# Altium schematic sheet Energy-Meter.SchDoc: Smart Energy Meter – Main Board
size A; CompanyName: Bleu Land; DrawnBy: Fox Black; Engineer: Fox Black; DocumentNumber: SEM-MB-001; Revision: A; SheetNumber: 1; SheetTotal: 1
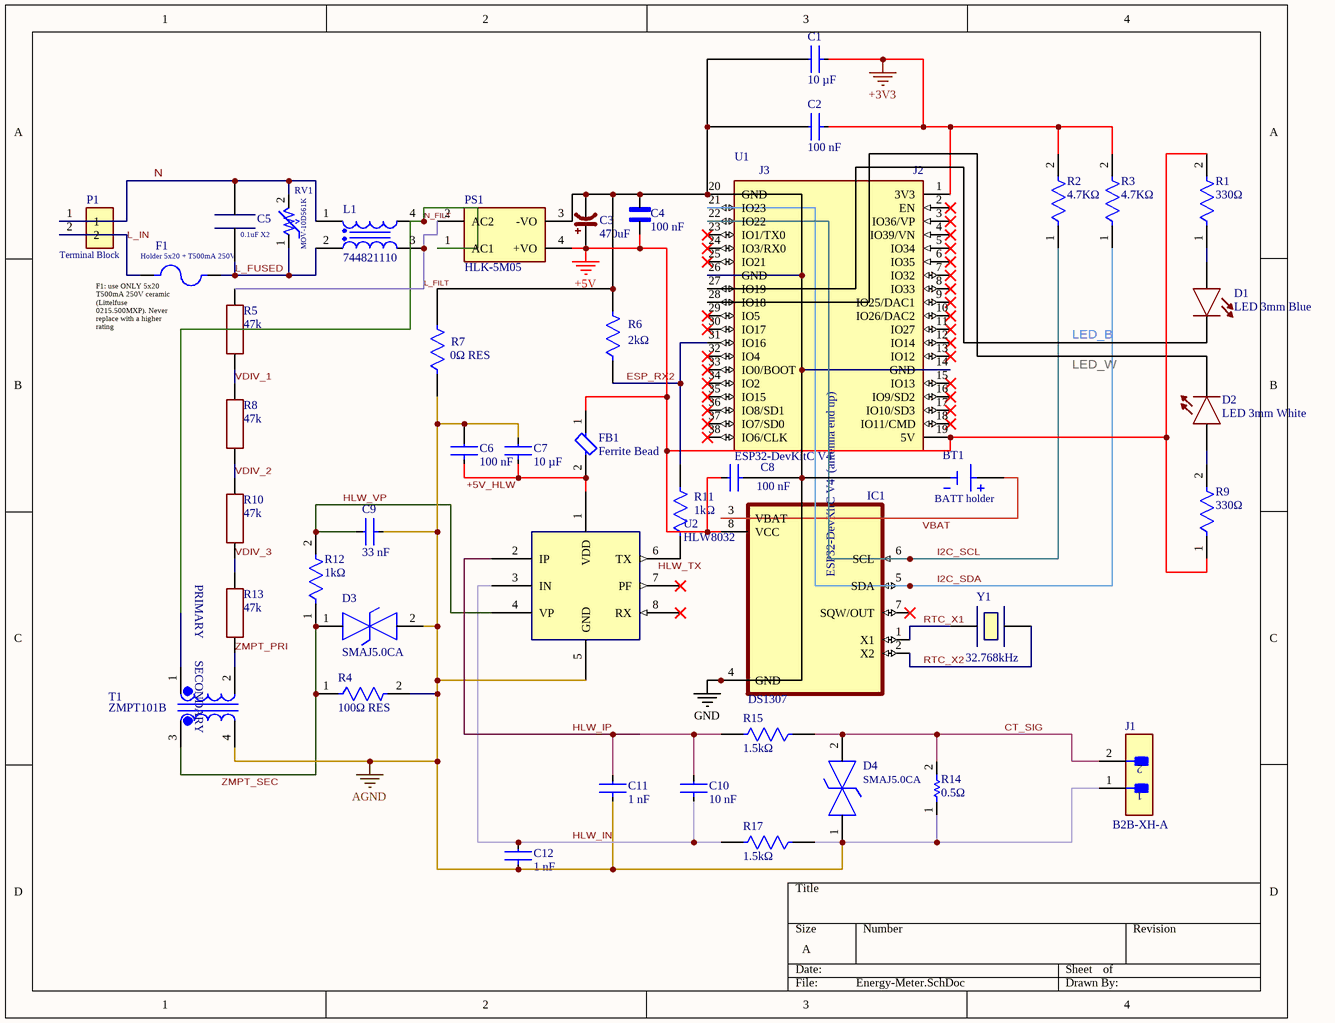
[diagram p0: Energy-Meter.SchDoc]

## Parts
BT1  BATT holder  [BAT_BH32T-C-G]
C1  10 µF  [FP-1206-L_3_2_0_2-W_1_6_0-MFG]
C2  100 nF  [FP-C1206C-EB-MFG]
C3  470uF  [CAPPRD350W60D800H1150_LAYDOWN]
C4  100 nF  [CAPRR508W50L508T318H762]
C5  0.1uF X2  [CAPX2_L18.0-W6.0-H11.0_P15.00]
C6  100 nF  [FP-C1206C-EB-MFG]
C7  10 µF  [FP-GRM31C-0_2-e0_3_0_8-IPC_C]
C8  100 nF  [FP-C1206C-EB-MFG]
C9  33 nF  [FP-C1206C-EB-MFG]
C10  10 nF  [FP-C1206C-EB-MFG]
C11  1 nF  [FP-C1206C-EB-MFG]
C12  1 nF  [FP-C1206C-EB-MFG]
D1  LED 3mm Blue  [LED_D3.0MM_P2.54_BLUE]
D2  LED 3mm White  [LED_D3.0MM_P2.54_WHITE]
D3  SMAJ5.0CA  [FP-SMAJ-MFG]
D4  SMAJ5.0CA  [FP-SMAJ-MFG]
F1  Holder 5x20 + T500mA 250V  [FUSE_4628]
FB1  Ferrite Bead  [FP-BLM31-0_2-t1_6-IPC_B]
IC1  DS1307  [DIP794W47P254L991H457Q8]
J1  B2B-XH-A  [FP-B2B-XH-AM_LF_SN-MFG]
L1  744821110  [WE-CMB_Type XS_L15W7.5H18]
P1  Terminal Block  [TE_282837-2]
PS1  HLK-5M05  [CONV_HLK-5M05]
R1  330Ω  [FP-AC2512-MFG]
R2  4.7KΩ  [FP-AC2512-MFG]
R3  4.7KΩ  [FP-AC2512-MFG]
R4  100Ω RES  [FP-MCA1206-IPC_A]
R5  47k  [RESAD762W55L630D240_MF]
R6  2kΩ  [FP-CRCW2512-e3-IPC_A]
R7  0Ω RES  [FP-RMCF2512-IPC_A]
R8  47k  [RESAD762W55L630D240_MF]
R9  330Ω  [FP-AC2512-MFG]
R10  47k  [RESAD762W55L630D240_MF]
R11  1kΩ  [FP-CRCW2512-e3-IPC_A]
R12  1kΩ  [FP-RMCF1206-IPC_C]
R13  47k  [RESAD762W55L630D240_MF]
R14  0.5Ω  [RESC6432X89X76ML25T25]
R15  1.5kΩ  [FP-CRCW2512-e3-IPC_A]
R17  1.5kΩ  [FP-CRCW2512-e3-IPC_A]
RV1  MOV-10D561K  [VAR_MOV-10D561K]
T1  ZMPT101B  [XFMR_ZMPT101B]
U1  ESP32-DevKitC V4  [ESP32-DEVKITC-V4_SOCKET]
U2  HLW8032  [SOIC127P600X175-8N]
Y1  32.768kHz  [XTAL_D3.2xL8.3_P2.00_Vertical]

## Nets
+3V3: C1.1 C2.1 R2.2 R3.2 U1.1(3V3)
+5V: C3.1(+) C4.1 C8.2 FB1.1 IC1.8(VCC) PS1.4(+VO) R1.2 R9.1 U1.19(5V)
AGND: C6.2 C7.2 C9.1 C11.1 C12.1 D3.2 D4.1 J1.1 R4.2 R7.1 R14.1 R17.1 T1.4 U2.5(GND)
GND: BT1.NEG C1.2 C2.2 C3.2(-) C4.2 C8.1 IC1.4(GND) PS1.3(-VO) R6.2 R7.2 U1.14(GND) U1.20(GND) U1.26(GND)
+5V_HLW: C6.1 C7.1 FB1.2 U2.1(VDD)
CT_SIG: D4.2 J1.2 R14.2 R15.1
ESP_RX2: R6.1 R11.2 U1.31(IO16)
HLW_IN: C10.1 C12.2 R17.2 U2.3(IN)
HLW_IP: C10.2 C11.2 R15.2 U2.2(IP)
HLW_TX: R11.1 U2.6(TX)
HLW_VP: C9.2 R12.2 U2.4(VP)
I2C_SCL: IC1.6(SCL) R2.1 U1.22(IO22)
I2C_SDA: IC1.5(SDA) R3.1 U1.21(IO23)
L_FILT: L1.3 PS1.2(AC2) R5.2
L_FUSED: C5.1 F1.2 L1.2 RV1.1
L_IN: F1.1 P1.2
LED_B: D1.1(K) U1.27(IO19)
LED_W: D2.1(K) U1.28(IO18)
N: C5.2 L1.1 P1.1 RV1.2
N_FILT: L1.4 PS1.1(AC1) T1.1
RTC_X1: IC1.1(X1) Y1.1
RTC_X2: IC1.2(X2) Y1.2
VBAT: BT1.POS IC1.3(VBAT)
VDIV_1: R5.1 R8.2
VDIV_2: R8.1 R10.2
VDIV_3: R10.1 R13.2
ZMPT_PRI: R13.1 T1.2
ZMPT_SEC: D3.1 R4.1 R12.1 T1.3
NetD1_2: D1.2(A) R1.1
NetD2_2: D2.2(A) R9.2

Not connected (* = marked no-connect by the designer): IC1 7(SQW/OUT)*; U1 2(EN)* 3(IO36/VP)* 4(IO39/VN)* 5(IO34)* 6(IO35)* 7(IO32)* 8(IO33)* 9(IO25/DAC1)* 10(IO26/DAC2)* 11(IO27)* 12(IO14)* 13(IO12)* 15(IO13)* 16(IO9/SD2)* 17(IO10/SD3)* 18(IO11/CMD)* 23(IO1/TX0)* 24(IO3/RX0)* 25(IO21)* 29(IO5)* 30(IO17)* 32(IO4)* 33(IO0/BOOT)* 34(IO2)* 35(IO15)* 36(IO8/SD1)* 37(IO7/SD0)* 38(IO6/CLK)*; U2 7(PF)* 8(RX)*

## Notes on the sheet
- (near F1) F1: use ONLY 5x20 T500mA 250V ceramic (Littelfuse 0215.500MXP). Never replace with a higher rating
- (in symbol ESP32-DEVKITC-V4) J3; J2; ESP32-DevKitC V4  (antenna end up)
- (in symbol ZMPT101B) PRIMARY; SECONDARY

## Library data of the parts
BT1 = BH32T-C-G: BATTERY HOLDER COIN 20MM PC PIN; Manufacturer: MPD; Manufacturer Part Number: BH32T-C-G
C1 = CMP-04427-021870-1: General Purpose Ceramic Capacitor, 1206, 10uF, 10%, X5R, 15%, 10V; Manufacturer: KYOCERA AVX; Manufacturer Part Number: 1206ZD106KAT2A; Tolerance: 10%; Thickness: 0.07inch; Voltage: 10V; Termination: SMD/SMT; REACH SVHC: No SVHC; Radiation Hardening: No; Capacitance: 10uF; Lead Free: Lead Free; Min Operating Temperature: -55°C; Contact Plating: Tin; Length: 3.2mm; Dielectric: X5R; Packaging: Tape and Reel; Construction: Flat; RoHS Compliant: Yes; Series: -; Voltage Rating: 10V; Height: 0.07mm; Width: 0.063inch; Voltage Rating (DC): 10V; Mount: Surface Mount; Depth: 1.6mm; Number of Pins: 2; Case Code (Imperial): 1206; Size: 1.78mm; Case/Package: 1206; Max Operating Temperature: 85°C; Package Quantity: 1; Case Code (Metric): 3216
C2 C6 C8 = CMP-03020-014296-1: CAP CER 0.1UF 25V X7R 1206; Manufacturer: KEMET; Manufacturer Part Number: C1206C104J3RACTU; Material: Ceramic; Value: 0.10 μF; Automotive Grade: Grade 0; Tolerance: 0.05; Temperature Coefficient: 15%; Octopart: https://octopart.com/c1206c104j3ractu-kemet-9140182; Height: 0.88mm; Ipc Land Pattern Name: CAPC320160X78; Digikey Description: CAP CER 0.1UF 25V X7R 1206; Device Class L3: Ceramic Capacitors; Device Class L2: Capacitors; Device Class L1: Passive Components; Voltage Rating: 25 V; RoHS: TRUE; Temperature Range Low: -55°C; Temperature Characteristic: X7R; Mouser Description: Cap Ceramic 0.1uF 25V X7R 5% SMD 1206 125°C Plastic T/R; Capacitance: 0.10 μF; ComponentLink2Description: Datasheet; Temperature: -55°C to +150°C; Automotive: Yes; Category: Cap; Temperature Range High: +150°C; ComponentLink2URL: https://content.kemet.com/datasheets/KEM_C1007_X8R_ULTRA_150C_SMD.pdf; Package: C1206C-EB; Lead Free: Yes
C3 = CAP_POL_470UF_10V_D8X11.5_LD: Capacitor, aluminium electrolytic, 470 uF, 10 V, 20%, radial D8x11.5mm, 3.5mm pitch, laid down; Manufacturer: Rubycon; Manufacturer Part Number: 10YXF470MEFC8X11.5; Capacitance: 470 µF; Voltage Rating: 10V; Polarized: Yes; Lead Diameter: 0.6mm; Lifetime: 6000h @ 105°C; Value: 470uF; Tolerance: ±20%; Technology: Aluminium Electrolytic; Case Size: D8 x L11.5 mm; Lead Spacing: 3.5mm; Mounting: THT, laid down (horizontal), leads bent 2mm from seal; Operating Temperature: -40°C ~ +105°C; ComponentLink1Description: Product page; ComponentLink1URL: https://www.digikey.com/product-detail/en/rubycon/10YXF470MEFC8X11-5/1189-1868-ND/3563329
C4 = AR215C104K4R: AR 100nF Ceramic Multilayer Cap,50V dc,+125C,X7R Dielectric,+/-10%,Through Hole | AVX AR215C104K4R; Package: Radial AVX; Manufacturer: AVX; Manufacturer Part Number: AR215C104K4R
C5 = CAP-X2-0.1uF-275VAC: Capacitor 0.1uF +/-10%, 275 VAC class X2, MKP polypropylene film, 40/100/21, radial through hole, 15 mm pitch; Manufacturer: TDK; Manufacturer Part Number: B32922C3104K000; Tolerance: +/-10% (K); Voltage: 305 VAC X2; Safety Class: X2, EN60384-14; Value: 0.1uF; Dielectric: MKP polypropylene film; Climatic Category: 40/100/21; Package: Boxed radial 18.0 x 11.0 x 6.0, P15
C7 = CMP-06035-005515-1: Chip Multilayer Ceramic Capacitors for General Purpose, 1206, 10uF, X7R, 15%, 10%, 25V; Manufacturer: Murata; Manufacturer Part Number: GRM31CR71E106KA12L; Dielectric: X7R; Max Operating Temperature: 125°C; Capacitance: 10uF; Voltage Rating (DC): 25V; Case/Package: 1206; Thickness: 0.071inch; Tolerance: 10%; Voltage Rating: 25V; Mount: Surface Mount; Width: 0.063inch; Length: 0.126inch; Min Operating Temperature: -55°C; Packaging: Tape and Reel; Lead Free: Lead Free; Voltage: 25V
C9 = CMP-03020-013243-1: C1206 33,000 pF C0G 5.00% 50 V; Manufacturer: KEMET; Manufacturer Part Number: C1206C333J5GACAUTO; Automotive Grade: Grade 0; Temperature Coefficient: 15%; Material: Ceramic; Voltage Rating: 50 V; Tolerance: 0.05; Package: C1206C-EB; ComponentLink2Description: Datasheet; Temperature Characteristic: C0G; Height: 0.88mm; Capacitance: 33,000 pF; Value: 33,000 pF; ComponentLink2URL: https://content.kemet.com/datasheets/KEM_C1007_X8R_ULTRA_150C_SMD.pdf; Lead Free: Yes; Device Class L1: Passive Components; Category: Cap; Octopart: https://octopart.com/c1206c333j5gacauto-kemet-84841138; Temperature Range High: +150°C; Automotive: Yes; Ipc Land Pattern Name: CAPC320160X78; Device Class L3: Ceramic Capacitors; Temperature: -55°C to +150°C; Device Class L2: Capacitors; Temperature Range Low: -55°C; RoHS: TRUE
C10 = CMP-03020-012568-1: CAP CER 10000PF 100V C0G 1206; Manufacturer: KEMET; Manufacturer Part Number: C1206C103J1GACAUTO; Material: Ceramic; Temperature Coefficient: 15%; Value: 10,000 pF; Tolerance: 0.05; Automotive Grade: Grade 0; Device Class L1: Passive Components; Height: 0.88mm; RoHS: TRUE; Voltage Rating: 100 V; Device Class L2: Capacitors; ComponentLink2Description: Datasheet; Temperature Range High: +150°C; Digikey Description: CAP CER 10000PF 100V C0G 1206; Temperature Range Low: -55°C; ComponentLink2URL: https://content.kemet.com/datasheets/KEM_C1007_X8R_ULTRA_150C_SMD.pdf; Ipc Land Pattern Name: CAPC320160X78; Temperature Characteristic: C0G; Category: Cap; Octopart: https://octopart.com/c1206c103j1gacauto-kemet-84841126; Lead Free: Yes; Automotive: Yes; Package: C1206C-EB; Capacitance: 10,000 pF; Temperature: -55°C to +150°C; Device Class L3: Ceramic Capacitors
C11 C12 = CMP-03020-025981-1: C1206 1,000 pF C0G 5.00% 200 V; Manufacturer Part Number: C1206C102J2GACAUTO; Manufacturer: KEMET; Automotive Grade: Grade 0; Temperature Coefficient: 15%; Material: Ceramic; Voltage Rating: 200 V; Tolerance: 0.05; Capacitance: 1,000 pF; Temperature: -55°C to +150°C; Ipc Land Pattern Name: CAPC320160X78; Device Class L1: Passive Components; Device Class L3: Ceramic Capacitors; ComponentLink2URL: https://content.kemet.com/datasheets/KEM_C1007_X8R_ULTRA_150C_SMD.pdf; Value: 1,000 pF; Category: Cap; RoHS: TRUE; Temperature Range Low: -55°C; Octopart: https://octopart.com/c1206c102j2gacauto-kemet-65740696; Height: 0.88mm; ComponentLink2Description: Datasheet; Automotive: Yes; Temperature Characteristic: C0G; Temperature Range High: +150°C; Lead Free: Yes; Device Class L2: Capacitors; Package: C1206C-EB
D1 = LED_3MM_BLUE_DIFFUSED: LED, 3mm round, blue diffused, THT 2.54mm; Manufacturer: Kingbright; Manufacturer Part Number: WP710A10QBD/D; Polarity: Pin 1 = K (cathode, square pad, flange flat, short lead); Pin 2 = A; Wavelength: 460nm peak; Forward Voltage: 3.3V typ / 4.0V max @ 20mA; Forward Current: 20mA typ / 30mA max; Reverse Voltage: 5V; Viewing Angle: 50 deg (diffused); Series Resistor @5V: 91-100 ohm (~17mA); Value: LED 3mm Blue; Package: 3mm (T-1) round, 2.54mm lead spacing; Lens: Blue diffused; Mounting: THT upright, flange ~1mm above board; Emitting Color: Blue; Operating Temperature: -40°C ~ +85°C; ComponentLink1Description: Part info; ComponentLink1URL: https://octopart.com/part/kingbright/WP710A10QBD%2FD
D2 = LED_3MM_WHITE_DIFFUSED: LED, 3mm round, white diffused, THT 2.54mm; Manufacturer: Kingbright; Manufacturer Part Number: L-7104QWC-D; Lens: Water clear; Polarity: Pin 1 = K (cathode, square pad, flange flat, short lead); Pin 2 = A; Emitting Color: White (cool white, ~6500K); Forward Voltage: 3.2V typ / 3.6V max @ 20mA; Forward Current: 20mA typ / 30mA max; Reverse Voltage: 5V; Viewing Angle: ~60 deg (diffused); Series Resistor @5V: 100 ohm (~18mA); Value: LED 3mm White; Package: 3mm (T-1) round, 2.54mm lead spacing; Mounting: THT upright, flange ~1mm above board; Operating Temperature: -40°C ~ +85°C
D3 D4 = CMP-2000-07091-2: TVS DIODE 5V 9.2V SMA; Manufacturer: Bourns Inc.; Direction: Bidirectional; Standoff Height: 0.05mm; Breakdown Voltage: 6.4V; Number Of Channels: 1; Max Junction Temp: +150°C; Peak Pulse Power: 400W; Lead Free: Yes; Digikey Description: TVS DIODE 5V 9.2V SMA; Automotive: No; Temperature: -55°C to +150°C; Package: SMAJ; Temperature Range Low: -55°C; Octopart: https://octopart.com/smaj5.0ca-bourns-12809390; Device Class L2: TVS Diodes; Device Class L3: unset; ComponentLink2URL: https://bourns.com/data/global/pdfs/SMAJ.pdf; RoHS: TRUE; ComponentLink2Description: Datasheet; Mouser Description: TVS Diodes - Transient Voltage Suppressors 5volts 800/1600uA 43.5 Amps Bi-Dir; Reverse Standoff Voltage: 5V; Temperature Range High: +150°C; Height: 2.62mm; Manufacturer Part Number: SMAJ5.0CA; Category: Diode; Device Class L1: Circuit Protection
F1 = 4628: 5mm Slim Line Fuse holder; Manufacturer: Keystone; Fuse Insert: Littelfuse 0215.500MXP (T500mA 250VAC ceramic 1.5kA); Manufacturer Part Number: 4628
FB1 = CMP-06046-002432-1: Chip Ferrite Bead, 1206, 600Ω @ 100MHz, 0.038Ω, 25%, 2.9A; Manufacturer: 125°C; Number of Lines: 1; DC Resistance (DCR): 38mR; Max Operating Temperature: 125°C; Packaging: Cut Tape; Min Operating Temperature: -55°C; Mount: Surface Mount; Case Code (Metric): 3216; Case/Package: 1206; Case Code (Imperial): 1206; Max Current Rating: 2.9A; Manufacturer Part Number: 125°C
IC1 = DS1307: Real Time Clock (RTC) I²C, 56 B RAM, 8-DIP; Manufacturer: Analog Devices; Manufacturer Part Number: DS1307+; Package: DIP-8 Maxim Integrated
J1 = CMP-17439-000037-1: CONN HEADER VERT 2POS 2.5MM; Manufacturer: JST; Manufacturer Part Number: B2B-XH-AM(LF)(SN); Max Voltage Rating (AC): 250V; Connector Type: Male Pin; Contact Resistance: 20mR; Max Current Rating: 3A; Number of Positions: 2; Series: XH; Contact Material: Brass; Mount: Through Hole; Housing Material: Polyamide; Contact Plating: Tin; Termination: Solder; Max Operating Temperature: 85°C; Depth: 5.75mm; Packaging: Bulk; Min Operating Temperature: -25°C; Contact Type: Male Pin; Color: Green; Pitch: 2.5mm; Length: 7.4mm; Lead Free: Lead Free; Number of Rows: 1; Fastening Type: Detent; Housing Color: White; Orientation: Straight
L1 = CMP-0223-00077-2: NexarPartId: 22865126; Manufacturer: Wurth Elektronik; Inductance: 10mH; Series Resistance: 350mΩ; Current: 700mA; Tolerance: 30%; Pin Length: 2.5mm; Voltage Rating: 250V; Test Frequency: 10kHz; Number of Lines: 2; Termination: Radial; Lead Pitch: 4.5mm; Height: 18mm; Width: 7.5mm; Packaging: Bulk; REACH SVHC: No SVHC; DC Current: 700mA; Min Operating Temperature: -40°C; Lead Free: Lead Free; Ambient Temperature Range High: 70°C; Depth: 7.5mm; Max Operating Temperature: 125°C; Length: 15mm; Current Rating: 700mA; DC Resistance (DCR): 350mΩ; Resistance: 350MΩ; Max DC Current: 700mA; Number of Pins: 4; Inductance Tolerance: 30%; Ambient Temperature Range Low: -40°C; RoHS: Compliant; Mount: Radial, Through Hole; Case/Package: Radial; Manufacturer Part Number: 744821110
P1 = 282837-2: Ð Ð°Ð·ÑŠÐµÐ¼Ð½Ñ‹Ðµ ÐºÐ»ÐµÐ¼Ð¼Ð½Ñ‹Ðµ ÐºÐ¾Ð»Ð¾Ð´ÐºÐ¸ Ð Ð¾Ð·ÐµÑ‚ÐºÐ° 2 Ð¿Ð¾Ð»Ð¾Ð¶ÐµÐ½Ð¸Ñ 5,08 Ð¼Ð¼ ÐŸÑ€Ð¸Ð¿Ð¾Ð¹ Ð¿Ñ€ÑÐ¼Ð¾Ð¹ Ñ‡ÐµÑ€ÐµÐ· Ð¾Ñ‚Ð²ÐµÑ€ÑÑ‚Ð¸Ðµ 13,5 Ð / ÐºÐ¾Ð½Ñ‚Ð°ÐºÑ‚; Manufacturer: TE Connectivity; Manufacturer Part Number: 282837-2
PS1 = HLK-5M05: AC DC 220V to 5V 5W 5Watt Isolated Switching Step-Down Power Supply Module Converter; Manufacturer: Hi-link; Manufacturer Part Number: HLK-5M05
R1 R9 = CMP-03412-030391-1: RES SMD 330 OHM 5% 1W 2512; Manufacturer: Yageo; Manufacturer Part Number: AC2512JK-07330RL; Automotive Grade: Grade 0; Tolerance: 0.05; Voltage Rating: 200V; Series: AC; Device Class L2: Resistors; Device Class L3: Chip SMD Resistors; Temperature Range Low: -55°C; Footprint Url: http://www.yageo.com/exep/pages/download/literatures/PYu-R_Mount_10.pdf; Digikey Description: RES SMD 330 OHM 5% 1W 2512; Resistance: 330Ω; Octopart: https://octopart.com/ac2512jk-07330rl-yageo-71370368; ComponentLink2Description: Datasheet; ComponentLink2URL: http://www.yageo.com/documents/recent/PYu-AC_51_RoHS_L_6.pdf; Value: 330Ω; Composition: Thick Film; Automotive: Yes; Ipc Land Pattern Name: RESC635310X55; Temperature: -55°C to +155°C; Temperature Range High: +155°C; Device Class L1: Passive Components; Height: 0.65mm; Category: Res; Power Rating: 1W; Package: AC2512; RoHS: TRUE; Lead Free: Yes
R2 R3 = CMP-03412-032212-1: RES SMD 4.7K OHM 1% 1W 2512; Manufacturer: Yageo; Manufacturer Part Number: AC2512FK-074K7L; Voltage Rating: 200V; Automotive Grade: Grade 0; Tolerance: 0.01; Resistance: 4.7KΩ; Temperature Range High: +155°C; Category: Res; RoHS: TRUE; ComponentLink2Description: Datasheet; Device Class L1: Passive Components; ComponentLink2URL: http://www.yageo.com/documents/recent/PYu-AC_51_RoHS_L_6.pdf; Package: AC2512; Series: AC; Power Rating: 1W; Temperature: -55°C to +155°C; Octopart: https://octopart.com/ac2512fk-074k7l-yageo-71370127; Lead Free: Yes; Value: 4.7KΩ; Height: 0.65mm; Digikey Description: RES SMD 4.7K OHM 1% 1W 2512; Footprint Url: http://www.yageo.com/exep/pages/download/literatures/PYu-R_Mount_10.pdf; Device Class L2: Resistors; Automotive: Yes; Temperature Range Low: -55°C; Device Class L3: Chip SMD Resistors; Composition: Thick Film; Ipc Land Pattern Name: RESC635310X55
R4 = CMP-02407-001396-1: Res MC AT Precision Thin Film 1206 100Ω 0.1% 0.4W ±25ppm/°C Molded Paper T/R; Manufacturer: Vishay; Manufacturer Part Number: MCA1206MD1000BP100; Resistance: 100R; Max Power Dissipation: 400mW; Voltage Rating: 200V; Number of Terminations: 2; Termination: SMD/SMT; Height: 0.026inch; Length: 0.126inch; Composition: Thin Film; Package Quantity: 1000; Min Operating Temperature: -55°C; Max Operating Temperature: 155°C; Tolerance: 0.1%; Case Code (Imperial): 1206; Case/Package: 1206; Case Code (Metric): 3216; Temperature Coefficient: 25ppm/°C; Power Rating: 400mW; Features: Automotive AEC-Q200; Weight: 0.000325oz; Width: 1.6mm; Packaging: Tape and Reel
R5 R8 R10 R13 = RES_47K_0.25W_1PCT_MF_7.62MM: Resistor, 47 kOhm, 1%, 0.25 W, metal film, axial THT, 7.62 mm pitch; Manufacturer: YAGEO; Manufacturer Part Number: MFR-25FRF52-47K; Resistance: 47 kOhm; Power: 0.25W (1/4W); Voltage Rating: 250V; Temperature Coefficient: ±100ppm/°C; Color Code: Yellow-Violet-Black-Red-Brown (5 band); Body Size: 6.3mm x 2.4mm dia; Lead Diameter: 0.55mm; Value: 47k; Tolerance: ±1%; Technology: Metal Film; Operating Temperature: -55°C ~ +155°C; Package: Axial, 7.62mm (0.3in) pitch, horizontal; ComponentLink1Description: Datasheet; ComponentLink1URL: https://yageogroup.com/content/Resource%20Library/Datasheet/YAGEO-MFR_DATASHEET.pdf
R6 = CMP-02407-009223-1: RES Thick Film, 2kΩ, 1%, 1W, 100ppm/°C, 2512; Manufacturer: Vishay; Manufacturer Part Number: CRCW25122K00FKEG; Voltage Rating (DC): 500V; Resistance: 2kR; Features: Automotive AEC-Q200; Weight: 0.001429oz; Case Code (Metric): 6432; Power Rating: 1W; Length: 6.3mm; Composition: Thick Film; Depth: 3.15mm; Min Operating Temperature: -55°C; Contact Plating: Tin; Number of Pins: 2; Packaging: Tape and Reel; Voltage Rating: 500V; Number of Terminations: 2; Tolerance: 1%; Termination: SMD/SMT; Lead Free: Lead Free; Temperature Coefficient: 100ppm/°C; Max Power Dissipation: 1W; Military Standard: Not; Height: 0.6mm; Package Quantity: 10; Radiation Hardening: No; Max Operating Temperature: 155°C; Case/Package: 2512; Case Code (Imperial): 2512; Width: 0.124inch
R7 = CMP-26527-000191-1: 0Ω ±0 1W 2512 Thick Film Chip Resistor AEC-Q200 compliant; Manufacturer: Stackpole; Manufacturer Part Number: RMCF2512ZT0R00; Tolerance: 5%; Temperature Coefficient: 200ppm/°C; Resistance: 0R; Case/Package: 2512; RoHS Compliant: Yes; Max Operating Temperature: 155°C; Max Power Dissipation: 1W; Power Rating: 1W; Radiation Hardening: No; Min Operating Temperature: -55°C; Features: Automotive AEC-Q200; Resistor Type: Thick Film; Case Code (Metric): 6432; Width: 0.126inch; Number of Terminations: 2; Case Code (Imperial): 2512; Mount: Surface Mount; Lead Free: Lead Free; Length: 6.3mm; Size Code: 2512; Depth: 3.2mm; Military Standard: Not; Contact Plating: Tin; Series: RMCF; Construction: Rectangular; Packaging: Tape and Reel; Height: 0.028inch
R11 = CMP-02407-005908-1: RES Thick Film, 1kΩ, 1%, 1W, 100ppm/°C, 2512; Manufacturer: Vishay; Manufacturer Part Number: CRCW25121K00FKEH; Resistance: 1kR; Length: 0.248inch; Min Operating Temperature: -55°C; Tolerance: 1%; Military Standard: Not; Max Operating Temperature: 155°C; Height: 0.028inch; Temperature Coefficient: 100ppm/°C; Packaging: Tape and Reel; Max Power Dissipation: 1W; Lead Free: Lead Free; Number of Terminations: 2; Features: Automotive AEC-Q200; Width: 0.124inch; Composition: Thick Film; Depth: 3.15mm; Power Rating: 1W; Case/Package: 2512
R12 = CMP-26527-005571-1: 1kΩ ±1% 0.25W 1206 Thick Film Chip Resistor AEC-Q200 compliant; Manufacturer: 155°C; Resistance: 1kR; Temperature Coefficient: 100ppm/°C; Max Power Dissipation: 250mW; Max Operating Temperature: 155°C; Contact Plating: Tin; Features: Automotive AEC-Q200; Min Operating Temperature: -55°C; Width: 0.063inch; Packaging: Tape and Reel; Number of Terminations: 2; Height: 0.028inch; Package Quantity: 10000; Series: RMCF; Case/Package: 1206; Radiation Hardening: No; Length: 0.126inch; RoHS Compliant: Yes; Mount: Surface Mount; Tolerance: 1%; Resistor Type: Thick Film; Manufacturer Part Number: 155°C
R14 = CMP-1666-00017-2: Chip Resistor, 0.5 Ohm, +/- 1%, 1 W, -65 to 275 degC, 2512 (6432 Metric), RoHS, Tape and Reel; Manufacturer Part Number: WSLT2512R5000FEA; Manufacturer: Vishay; Resistance: 0.5 Ohm; REACH SVHC: Unknown; Length: 6.35 mm; Case Code (Imperial): 2512; ComponentLink1Description: Manufacturer URL; Case Code (Metric): 6432; ComponentLink1URL: http://www.vishay.com/; Max Operating Temperature: 275 degC; PackageDescription: 2-Pin Surface Mount Device, Body 6.35 x 3.18 mm; Min Operating Temperature: -65 degC; ComponentLink2Description: Datasheet; Tolerance: 1%; Case/Package: 2512; Radiation Hardening: No; RoHSCompliant: True; Packaging: Tape and Reel; ComponentLink2URL: http://www.farnell.com/datasheets/1813046.pdf; Mounting Technology: Surface Mount; DatasheetVersion: 11/2011; Height: 0.635 mm; Width: 3.2 mm
R15 R17 = CMP-02407-008685-1: RES Thick Film, 1.5kΩ, 1%, 1W, 100ppm/°C, 2512; Manufacturer: Vishay; Manufacturer Part Number: CRCW25121K50FKEG; Resistance: 1.5kR; Voltage Rating: 500V; Features: Automotive AEC-Q200; Termination: SMD/SMT; Max Power Dissipation: 1W; Temperature Coefficient: 100ppm/°C; Power Rating: 1W; Min Operating Temperature: -55°C; Tolerance: 1%; Weight: 0.001429oz; Max Operating Temperature: 155°C; Case Code (Metric): 6332; Military Standard: Not; Radiation Hardening: No; Package Quantity: 10; Lead Free: Lead Free; Length: 6.3mm; Case Code (Imperial): 2512; Composition: Thick Film; Contact Plating: Tin; Packaging: Tape and Reel; Width: 0.124inch; Number of Terminations: 2; Depth: 3.15mm; Case/Package: 2512; Height: 0.028inch; Voltage Rating (DC): 500V
RV1 = MOV-10D561K: 560 V 2.5 kA Varistor 1 Circuit Through Hole Disc 10mm; Manufacturer: Bourns; Manufacturer Part Number: MOV-10D561K
T1 = ZMPT101B: Current-type Voltage Transformer; Manufacturer: Qingxian Zeming Langxi Electronic; Manufacturer Part Number: ZMPT101B
U1 = ESP32-DEVKITC-V4: Espressif ESP32-DevKitC V4 (ESP32-WROOM-32E) dev board, socketed on 2x19 female headers; Manufacturer: Espressif Systems; Manufacturer Part Number: ESP32-DEVKITC-32E; Header Parts: 2x 1x19 female header 2.54mm, 8.5mm (order separately); Module: ESP32-WROOM-32E, 4 MB flash; Supply: 5V on pin 19 or USB, 3V3 on pin 1; Module PCB Bottom Height: 11.0mm above board; Free Space Under Module: 22.8mm wide x 48mm long x 11.0mm high (between header rows); Pin Notes: IO6-IO11 used by SPI flash; IO16/IO17 reserved on WROVER boards; IO34-39 input only; Value: ESP32-DevKitC V4; Mounting: Socketed: 2x 1x19 female header 2.54mm, 8.5mm tall, rows 25.4mm apart; ComponentLink1Description: User guide / pinout; ComponentLink1URL: https://docs.espressif.com/projects/esp-dev-kits/en/latest/esp32/esp32-devkitc/user_guide.html; ComponentLink2Description: DigiKey; ComponentLink2URL: https://www.digikey.com/en/products/detail/espressif-systems/ESP32-DEVKITC-32E/12091810
U2 = HLW8032: High-precision single-phase energy metering IC, dual sigma-delta ADC, UART 4800bps, PF pulse output, 5V, SOP-8; Manufacturer: Hiliwei Tech; Package: SOP-8 (150mil); Value: HLW8032; Manufacturer Part Number: HLW8032; Supplier Part: C128023; Supply Voltage: 5V; HelpURL: https://datasheet.lcsc.com/lcsc/2307271600_Hiliwei-Tech-HLW8032_C128023.pdf
Y1 = XTAL-32.768kHz: Crystal 32.768 kHz, 12.5 pF, +/-20 ppm, tuning fork, 3 x 8 mm cylindrical can, through hole, vertical; Manufacturer Part Number: AB38T-32.768KHZ; Manufacturer: Abracon; Load Capacitance: 12.5pF; ESR: 30kOhm max; Value: 32.768kHz; Tolerance: +/-20ppm; Package: Cylinder D3.2 x L8.3 (3x8mm); HelpURL: https://abracon.com/Resonators/AB38T.pdf